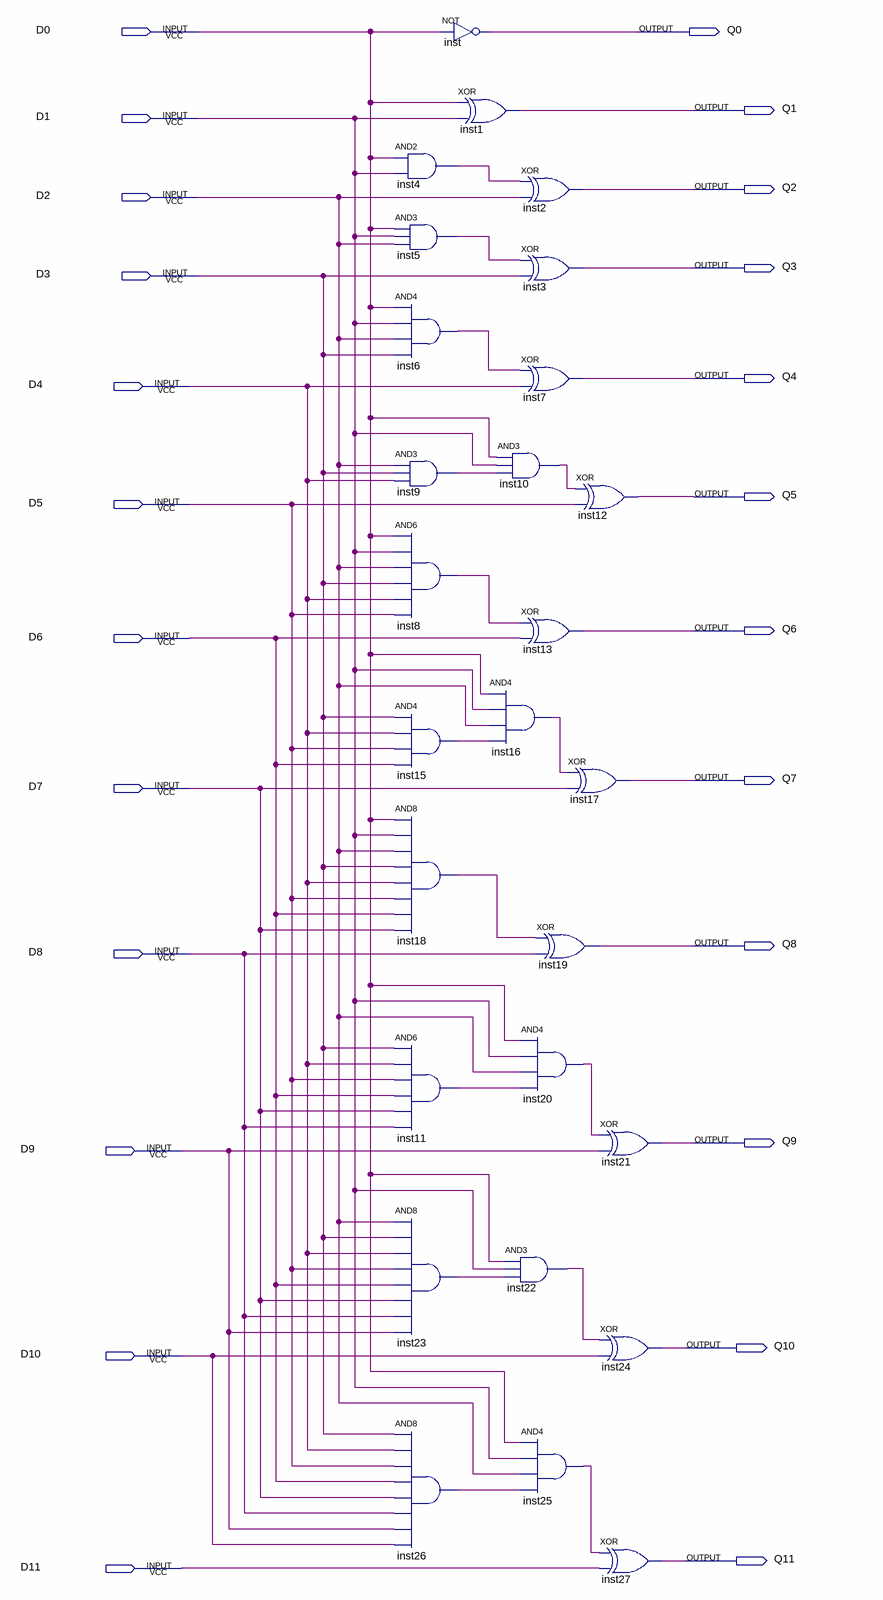
[diagram p0: schematic sheet]
// Quartus schematic Increment_12.bdf as structural Verilog: 27 symbols, 24 pins
module Increment_12 (
  input  D0,
  input  D1,
  input  D2,
  input  D3,
  input  D4,
  input  D5,
  input  D6,
  input  D7,
  input  D8,
  input  D9,
  input  D10,
  input  D11,
  output Q0,
  output Q1,
  output Q2,
  output Q3,
  output Q4,
  output Q5,
  output Q6,
  output Q7,
  output Q8,
  output Q9,
  output Q10,
  output Q11
);

  wire inst4_out, inst5_out, inst6_out, inst8_out, inst9_out, inst10_out, inst11_out, inst15_out, inst16_out,
       inst18_out, inst20_out, inst22_out, inst23_out, inst25_out, inst26_out;

  and inst4 (inst4_out, D0, D1);
  and inst5 (inst5_out, D0, D1, D2);
  and inst6 (inst6_out, D0, D1, D2, D3);
  and inst9 (inst9_out, D2, D3, D4);
  and inst8 (inst8_out, D0, D1, D2, D3, D4, D5);
  and inst15 (inst15_out, D3, D4, D5, D6);
  and inst18 (inst18_out, D0, D1, D2, D3, D4, D5, D6, D7);
  and inst11 (inst11_out, D3, D4, D5, D6, D7, D8);
  and inst23 (inst23_out, D2, D3, D4, D5, D6, D7, D8, D9);
  and inst26 (inst26_out, D3, D4, D5, D6, D7, D8, D9, D10);
  not inst (Q0, D0);
  xor inst1 (Q1, D0, D1);
  and inst16 (inst16_out, D0, D1, D2, inst15_out);
  xor inst2 (Q2, inst4_out, D2);
  xor inst3 (Q3, inst5_out, D3);
  xor inst7 (Q4, inst6_out, D4);
  and inst10 (inst10_out, D0, D1, inst9_out);
  xor inst13 (Q6, inst8_out, D6);
  xor inst19 (Q8, inst18_out, D8);
  and inst20 (inst20_out, D0, D1, D2, inst11_out);
  and inst22 (inst22_out, D0, D1, inst23_out);
  and inst25 (inst25_out, D0, D1, D2, inst26_out);
  xor inst12 (Q5, inst10_out, D5);
  xor inst17 (Q7, inst16_out, D7);
  xor inst21 (Q9, inst20_out, D9);
  xor inst24 (Q10, inst22_out, D10);
  xor inst27 (Q11, inst25_out, D11);
endmodule
